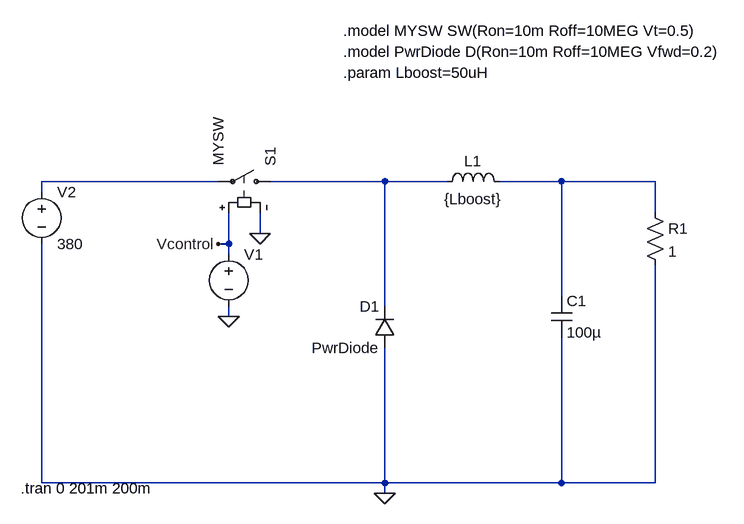
[diagram p0: schematic BuckConverter.asc]
BuckConverter.asc, the LTspice schematic file:
Version 4
SHEET 1 1052 680
WIRE 224 -48 -48 -48
WIRE 480 -48 304 -48
WIRE 576 -48 480 -48
WIRE 752 -48 656 -48
WIRE 896 -48 752 -48
WIRE -48 -32 -48 -48
WIRE 896 0 896 -48
WIRE 288 32 288 0
WIRE 240 48 240 0
WIRE 240 48 224 48
WIRE 240 64 240 48
WIRE 752 128 752 -48
WIRE 480 144 480 -48
WIRE 240 160 240 144
WIRE -48 416 -48 48
WIRE 480 416 480 208
WIRE 480 416 -48 416
WIRE 752 416 752 192
WIRE 752 416 480 416
WIRE 896 416 896 80
WIRE 896 416 752 416
WIRE 480 432 480 416
FLAG 288 32 0
FLAG 240 160 0
FLAG 224 48 Vcontrol
FLAG 480 432 0
SYMBOL sw 320 -48 M270
SYMATTR InstName S1
SYMATTR Value MYSW
SYMBOL voltage 240 48 R0
WINDOW 3 15 111 Invisible 2
WINDOW 123 0 0 Left 0
WINDOW 39 0 0 Left 0
SYMATTR Value PULSE(0 1 0 1n 1n {0.054*50u} 50u)
SYMATTR InstName V1
SYMBOL ind 560 -32 R270
WINDOW 0 32 56 VTop 2
WINDOW 3 5 56 VBottom 2
SYMATTR InstName L1
SYMATTR Value {Lboost}
SYMBOL diode 496 208 R180
WINDOW 0 24 64 Left 2
WINDOW 3 24 0 Left 2
SYMATTR InstName D1
SYMATTR Value PwrDiode
SYMBOL cap 736 128 R0
SYMATTR InstName C1
SYMATTR Value 100µ
SYMBOL res 880 -16 R0
SYMATTR InstName R1
SYMATTR Value 1
SYMBOL voltage -48 -48 R0
WINDOW 123 0 0 Left 0
WINDOW 39 0 0 Left 0
SYMATTR InstName V2
SYMATTR Value 380
TEXT -80 424 Left 2 !.tran 0 201m 200m
TEXT 416 -280 Left 2 !.model MYSW SW(Ron=10m Roff=10MEG Vt=0.5)
TEXT 416 -216 Left 2 !.param Lboost=50uH
TEXT 416 -248 Left 2 !.model PwrDiode D(Ron=10m Roff=10MEG Vfwd=0.2)

The netlist it stands for:
* BuckConverter.asc
S1 N002 N001 Vcontrol 0 MYSW
V1 Vcontrol 0 PULSE(0 1 0 1n 1n {0.054*50u} 50u)
L1 N002 N003 {Lboost}
D1 0 N002 PwrDiode
C1 N003 0 100µ
R1 N003 0 1
V2 N001 0 380
.model D D
.lib standard.dio
.tran 0 201m 200m
.model MYSW SW(Ron=10m Roff=10MEG Vt=0.5)
.param Lboost=50uH
.model PwrDiode D(Ron=10m Roff=10MEG Vfwd=0.2)
.backanno
.end